# Altium schematic sheet AMS_Slave_Measurement.SchDoc
size A3; SheetNumber: 3; SheetTotal: 3
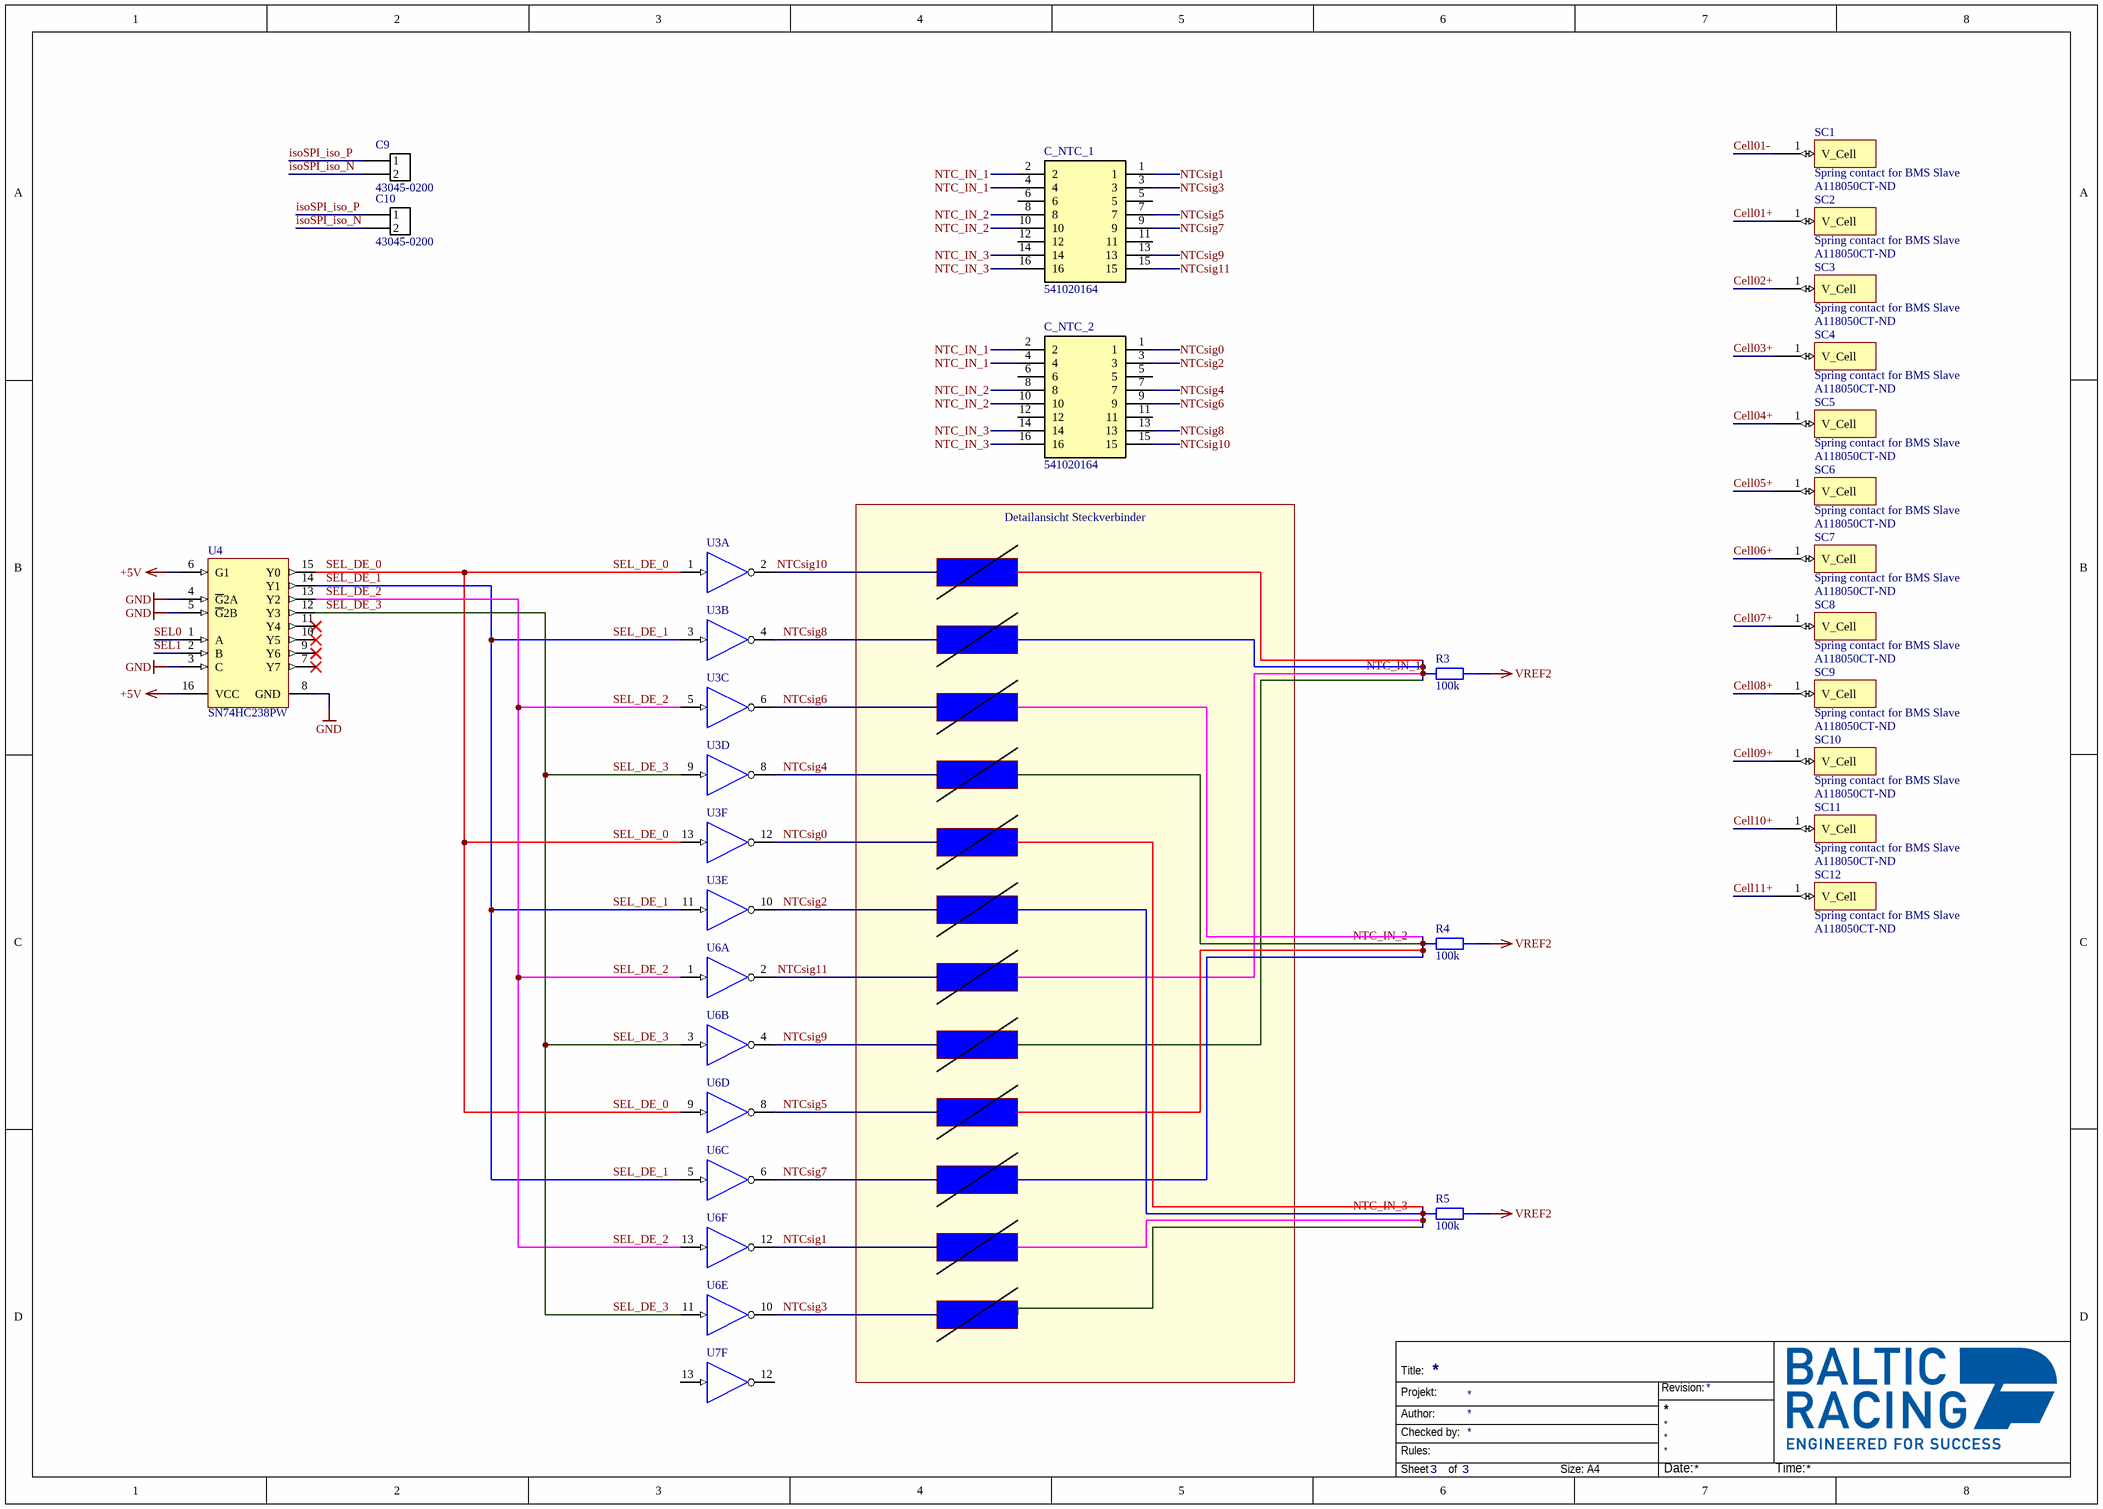
[diagram p0: AMS_Slave_Measurement.SchDoc]

## Parts
C9  43045-0200  [43650-0200]
C10  43045-0200  [43650-0200]
C_NTC_1  541020164  [541020164]
C_NTC_2  541020164  [541020164]
R3  value 100k  [STACKPOLE CSR0603]  (hidden comment: SMD Resistor)
R4  value 100k  [STACKPOLE CSR0603]  (hidden comment: SMD Resistor)
R5  value 100k  [STACKPOLE CSR0603]  (hidden comment: SMD Resistor)
SC1  Spring contact for BMS Slave  Supplier Part Number 1: A118050CT-ND  [1734300-1 Spring Contact]
SC2  Spring contact for BMS Slave  Supplier Part Number 1: A118050CT-ND  [1734300-1 Spring Contact]
SC3  Spring contact for BMS Slave  Supplier Part Number 1: A118050CT-ND  [1734300-1 Spring Contact]
SC4  Spring contact for BMS Slave  Supplier Part Number 1: A118050CT-ND  [1734300-1 Spring Contact]
SC5  Spring contact for BMS Slave  Supplier Part Number 1: A118050CT-ND  [1734300-1 Spring Contact]
SC6  Spring contact for BMS Slave  Supplier Part Number 1: A118050CT-ND  [1734300-1 Spring Contact]
SC7  Spring contact for BMS Slave  Supplier Part Number 1: A118050CT-ND  [1734300-1 Spring Contact]
SC8  Spring contact for BMS Slave  Supplier Part Number 1: A118050CT-ND  [1734300-1 Spring Contact]
SC9  Spring contact for BMS Slave  Supplier Part Number 1: A118050CT-ND  [1734300-1 Spring Contact]
SC10  Spring contact for BMS Slave  Supplier Part Number 1: A118050CT-ND  [1734300-1 Spring Contact]
SC11  Spring contact for BMS Slave  Supplier Part Number 1: A118050CT-ND  [1734300-1 Spring Contact]
SC12  Spring contact for BMS Slave  Supplier Part Number 1: A118050CT-ND  [1734300-1 Spring Contact]
U3  SN74LVC06APWR  [PW0014A_M]  (value not drawn)  (parts A,B,C,D,E,F of 7)
U4  SN74HC238PW  [SN74HC238PW Footprint]
U6  SN74LVC06APWR  [PW0014A_M]  (value not drawn)  (parts A,B,C,D,E,F of 7)
U7  SN74LVC06APWR  [PW0014A_M]  (value not drawn)  (part F of 7)

## Nets
+5V: U4.6(G1) U4.16(VCC)
GND: U4.3(C) U4.4(~{G}2A) U4.5(~{G}2B) U4.8(GND)
VREF2: R3.2 R4.2 R5.2
Cell01+: SC2.1(V_Cell)
Cell01-: SC1.1(V_Cell)
Cell02+: SC3.1(V_Cell)
Cell03+: SC4.1(V_Cell)
Cell04+: SC5.1(V_Cell)
Cell05+: SC6.1(V_Cell)
Cell06+: SC7.1(V_Cell)
Cell07+: SC8.1(V_Cell)
Cell08+: SC9.1(V_Cell)
Cell09+: SC10.1(V_Cell)
Cell10+: SC11.1(V_Cell)
Cell11+: SC12.1(V_Cell)
isoSPI_iso_N: C9.2 C10.2
isoSPI_iso_P: C9.1 C10.1
NTC_IN_1: C_NTC_1.2 C_NTC_1.4 C_NTC_2.2 C_NTC_2.4 R3.1
NTC_IN_2: C_NTC_1.8 C_NTC_1.10 C_NTC_2.8 C_NTC_2.10 R4.1
NTC_IN_3: C_NTC_1.14 C_NTC_1.16 C_NTC_2.14 C_NTC_2.16 R5.1
NTCsig0: C_NTC_2.1 U3.12(~{6Y})
NTCsig1: C_NTC_1.1 U6.12(~{6Y})
NTCsig2: C_NTC_2.3 U3.10(~{5Y})
NTCsig3: C_NTC_1.3 U6.10(~{5Y})
NTCsig4: C_NTC_2.7 U3.8(~{4Y})
NTCsig5: C_NTC_1.7 U6.8(~{4Y})
NTCsig6: C_NTC_2.9 U3.6(~{3Y})
NTCsig7: C_NTC_1.9 U6.6(~{3Y})
NTCsig8: C_NTC_2.13 U3.4(~{2Y})
NTCsig9: C_NTC_1.13 U6.4(~{2Y})
NTCsig10: C_NTC_2.15 U3.2(~{1Y})
NTCsig11: C_NTC_1.15 U6.2(~{1Y})
SEL0: U4.1(A)
SEL1: U4.2(B)
SEL_DE_0: U3.1(1A) U3.13(6A) U4.15(Y0) U6.9(4A)
SEL_DE_1: U3.3(2A) U3.11(5A) U4.14(Y1) U6.5(3A)
SEL_DE_2: U3.5(3A) U4.13(Y2) U6.1(1A) U6.13(6A)
SEL_DE_3: U3.9(4A) U4.12(Y3) U6.3(2A) U6.11(5A)

Not connected (* = marked no-connect by the designer): C_NTC_1 5 6 11 12; C_NTC_2 5 6 11 12; U4 7(Y7)* 9(Y6)* 10(Y5)* 11(Y4)*; U7 12(~{6Y}) 13(6A)

## Notes on the sheet
- Detailansicht Steckverbinder
- Title:
- Projekt:
- Revision:
- Author:
- Rules:
- Checked by:
- Sheet
- of
- Size:
- A4
- Date:
- Time:

## Library data of the parts
C9 C10 = MicroFit3.0 2-Pin: Molex Micro-Fit 3.0 2-Pin / 600V / 8.5A
C_NTC_1 C_NTC_2 = 541020164: 0.50mm Pitch SlimStack Receptacle, Surface Mount, Dual Row, Vertical, 2.50mm Stacking Height, Gold Plating with Nickel Barrier, 16 Circuits
R3-R5 = SMD Resistor: Resistor with multiple footprints
SC1-SC12 = 1734300-1: PCB Spring Contact, C-Clip, Uncompressed Height 3 mm [.118 in], Length 4.5 mm [.177 in], Width .098 in [2.5 mm]; Supplier 1: Digi-Key
U3 U6 U7 = CMP-1615-01057-2: Hex Inverter Buffers/Drivers With Open-Drain Outputs, PW0014A, LARGE T&R; Manufacturer: Texas Instruments; Technology Family: LVC; Output Drive (IOL/IOH)(Max)(mA): -24/24; VCC(Min)(V): 1.65; Voltage(Nom)(V): 1.8,2.5,2.7,3.3; Schmitt Trigger: No; Rating: Catalog; F @ Nom Voltage(Max)(Mhz): 100; Bits(#): 6; Input Type: CMOS,TTL; ICC @ Nom Voltage(Max)(mA): 0.04; tpd @ Nom Voltage(Max)(ns): 5.6,3.1,3.9,3.7; Output Type: CMOS; VCC(Max)(V): 3.6; PackageReference: PW0014A; Operating Temperature Range(C): -40 to 125; DatasheetVersion: SCAS596N; Generic Part Number: SN74LVC06A; Code_JEDEC: MO-153